# Altium schematic sheet NAND flash.SchDoc
size A4; SheetNumber: 5; SheetTotal: 12
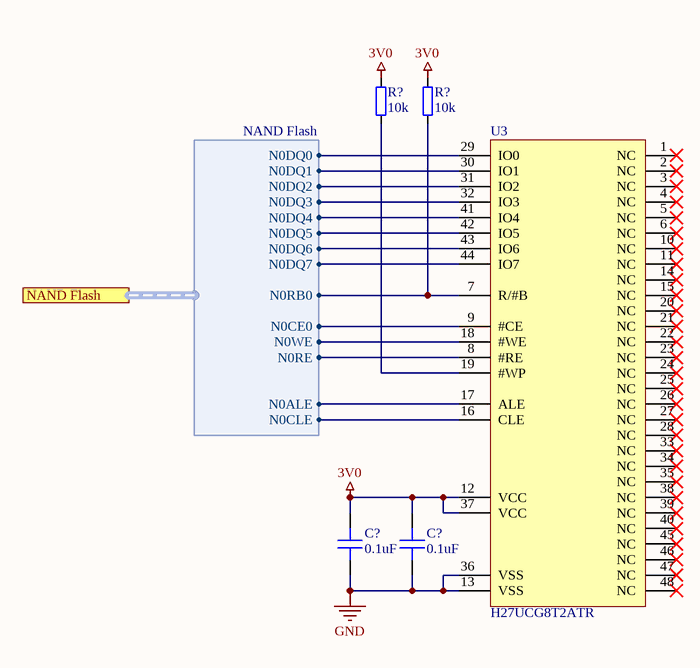
[diagram p0: NAND flash.SchDoc]

## Parts
(Parts that share a designator on the sheet are numbered #1, #2 ... from top to bottom, then left to right.)
C?#1  0.1uF  [CAPC1005X06N]
C?#2  0.1uF  [CAPC1005X06N]
R?#1  10k  [RESC1005X35N]
R?#2  10k  [RESC1005X35N]
U3  H27UCG8T2ATR  [TSSOP50P2000X120-48N]

## Ports
NAND Flash (harness NAND Flash)

## Harnesses
NAND Flash: N0DQ0, N0DQ1, N0DQ2, N0DQ3, N0DQ4, N0DQ5, N0DQ6, N0DQ7, N0RB0, N0CE0, N0WE, N0RE, N0ALE, N0CLE

## Nets
3V0: C?#1.1 C?#2.1 R?#1.1 R?#2.2 U3.12(VCC) U3.37(VCC)
GND: C?#1.2 C?#2.2 U3.13(VSS) U3.36(VSS)
NetR?#1_2: R?#1.2 U3.19(#WP)
NetR?#2_1: R?#2.1 U3.7(R/#B) ; port NAND Flash.N0RB0
NetU3_8: U3.8(#RE) ; port NAND Flash.N0RE
NetU3_9: U3.9(#CE) ; port NAND Flash.N0CE0
NetU3_16: U3.16(CLE) ; port NAND Flash.N0CLE
NetU3_17: U3.17(ALE) ; port NAND Flash.N0ALE
NetU3_18: U3.18(#WE) ; port NAND Flash.N0WE
NetU3_29: U3.29(IO0) ; port NAND Flash.N0DQ0
NetU3_30: U3.30(IO1) ; port NAND Flash.N0DQ1
NetU3_31: U3.31(IO2) ; port NAND Flash.N0DQ2
NetU3_32: U3.32(IO3) ; port NAND Flash.N0DQ3
NetU3_41: U3.41(IO4) ; port NAND Flash.N0DQ4
NetU3_42: U3.42(IO5) ; port NAND Flash.N0DQ5
NetU3_43: U3.43(IO6) ; port NAND Flash.N0DQ6
NetU3_44: U3.44(IO7) ; port NAND Flash.N0DQ7

Not connected (* = marked no-connect by the designer): U3 1(NC)* 2(NC)* 3(NC)* 4(NC)* 5(NC)* 6(NC)* 10(NC)* 11(NC)* 14(NC)* 15(NC)* 20(NC)* 21(NC)* 22(NC)* 23(NC)* 24(NC)* 25(NC)* 26(NC)* 27(NC)* 28(NC)* 33(NC)* 34(NC)* 35(NC)* 38(NC)* 39(NC)* 40(NC)* 45(NC)* 46(NC)* 47(NC)* 48(NC)*

## Library data of the parts
C?#1 C?#2 = 0402B104K500CT: Manufacturer: Walsin Tech Corp; Voltage: 50V; Tolerance: 10%; Dielectric: X7R; Min Temperature: -55; Max Temperature: 125; Part Number: 0402B104K500CT; ComponentLink1URL: https://datasheet.lcsc.com/lcsc/1810191621_Walsin-Tech-Corp-0402B104K500CT_C152814.pdf; ComponentLink1Description: Datasheet; Package: 0402; Part Status: Active; Capacitance: 0.1uF
R?#1 R?#2 = WR04X1002FTL: Resistor; Manufacturer: Walsin Tech Corp; Tolerance: 1%; Power: 1/16 W; Temperature Coefficient: 100ppm; Min Temperature: -55°C; Max Temperature: 155°C; Part Number: WR04X1002FTL; ComponentLink1URL: https://datasheet.lcsc.com/lcsc/2304140030_Walsin-Tech-Corp-WR04X1002FTL_C163810.pdf; ComponentLink1Description: Datasheet; Package: 0402; Part Status: Active; Resistance: 10k
U3 = H27UCG8T2ATR: NAND Flash Memory; MANUFACTURER: SK Hynix; Part Number: H27UCG8T2ATR; COMPONENTLINK1URL: https://z3d9b7u8.stackpathcdn.com/pdf-down/H/2/7/H27UCG8T2ATR-BC-Hynix.pdf; COMPONENTLINK1DESCRIPTION: Datasheet; PACKAGE: TSSOP-48; Part Status: Active